# Altium schematic sheet Sheet1.SchDoc
size A4
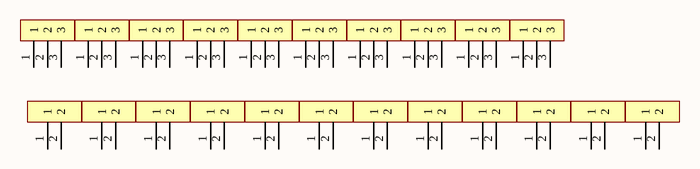
[diagram p0: Sheet1.SchDoc]

## Parts
P1  3P  [3P]  (value not drawn)
P2  3P  [3P]  (value not drawn)
P3  3P  [3P]  (value not drawn)
P4  3P  [3P]  (value not drawn)
P5  3P  [3P]  (value not drawn)
P6  3P  [3P]  (value not drawn)
P7  3P  [3P]  (value not drawn)
P8  3P  [3P]  (value not drawn)
P9  3P  [3P]  (value not drawn)
P10  3P  [3P]  (value not drawn)
P11  2P  [2P]  (value not drawn)
P12  2P  [2P]  (value not drawn)
P13  2P  [2P]  (value not drawn)
P14  2P  [2P]  (value not drawn)
P15  2P  [2P]  (value not drawn)
P16  2P  [2P]  (value not drawn)
P17  2P  [2P]  (value not drawn)
P18  2P  [2P]  (value not drawn)
P19  2P  [2P]  (value not drawn)
P20  2P  [2P]  (value not drawn)
P21  2P  [2P]  (value not drawn)
P22  2P  [2P]  (value not drawn)

## Nets

Not connected (* = marked no-connect by the designer): P1 1 2 3; P2 1 2 3; P3 1 2 3; P4 1 2 3; P5 1 2 3; P6 1 2 3; P7 1 2 3; P8 1 2 3; P9 1 2 3; P10 1 2 3; P11 1 2; P12 1 2; P13 1 2; P14 1 2; P15 1 2; P16 1 2; P17 1 2; P18 1 2; P19 1 2; P20 1 2; P21 1 2; P22 1 2